# EAGLE design LTC3528 (EAGLE 7.5.0)
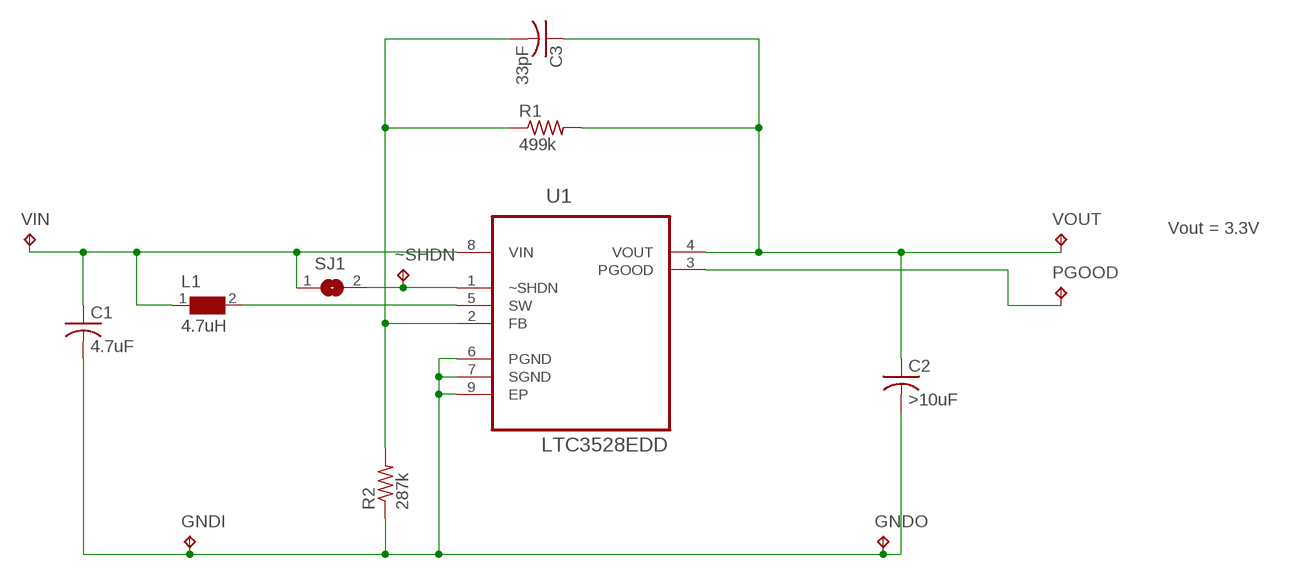
[diagram p0: schematic, sheet 1]

## Parts
C1  4.7uF  C-USC0603  [C0603]
C2  >10uF  C-USC0603  [C0603]
C3  33pF  C-USC0603  [C0603]
GNDI  TPPAD1-13  [P1-13]
GNDO  TPPAD1-13  [P1-13]
L1  4.7uH  WE-TPC-74402500047_2828  [WE-TPC_2828]
PGOOD  TPPAD1-13  [P1-13]
R1  499k  R-US_R0603  [R0603]
R2  287k  R-US_R0603  [R0603]
SJ1  not SHDN  SJ  [SJ]
U1  LTC3528EDD  LTC3528EDDB-2PBF  [DFN300X200X80-9N]
VIN  TPPAD1-13  [P1-13]
VOUT  TPPAD1-13  [P1-13]
~SHDN  TPPAD1-13  [P1-13]

## Nets
GND: C1.2 C2.2 GNDI.TP GNDO.TP R2.1 U1.6(PGND) U1.7(SGND) U1.9(EP)
N$1: SJ1.2 U1.1(~SHDN) ~SHDN.TP
N$3: PGOOD.TP U1.3(PGOOD)
N$4: L1.2 U1.5(SW)
N$8: C3.2 R1.1 R2.2 U1.2(FB)
VIN: C1.1 L1.1 SJ1.1 U1.8(VIN) VIN.TP
VOUT: C2.1 C3.1 R1.2 U1.4(VOUT) VOUT.TP

## Notes on the sheet
- Vout = 3.3V

## Library data of the parts
C1-C3 = rcl:C-US: CAPACITOR, American symbol
GNDI GNDO ~SHDN = testpad:TP: Test pad
L1 = WE-TPC:WE-TPC: Shielded Tiny Power Inductor WE-TPC - Extremely flat power inductor - High current capability - High reliability and perfect soldering characteristics because of integrated soldering pad - magnetically shielded -- Portable power like PDA, digital camera, PCMICA-cards and displays -- DC/DC-converter -- Recommended for switching regulator IC's from Linear Technology, National Semiconductor, Texas Instruments and Fairchild Semiconductor; MPN: 74402500047; OC_FARNELL: 1869738; OC_NEWARK: 32T8550; PACKAGE: 2828; SUPPLIER: WURTH ELEKTRONIK
PGOOD = testpad:TP: Test pad; TP_SIGNAL_NAME: PGOOD
R1 R2 = rcl:R-US_: RESISTOR, American symbol
SJ1 = jumper:SJ: SMD solder JUMPER
U1 = LTC_By_element14_Batch_1:LTC3528EDDB-2PBF: 1A, 1MHz Synchronous Step-Up DC/DC Converters; MPN: LTC3528EDDB-2#PBF; OC_FARNELL: 1783296; OC_NEWARK: 51R1507; PACKAGE: DFN-8; SUPPLIER: Linear Technology
VIN = testpad:TP: Test pad; TP_SIGNAL_NAME: VIN
VOUT = testpad:TP: Test pad; TP_SIGNAL_NAME: VOUT

## Board
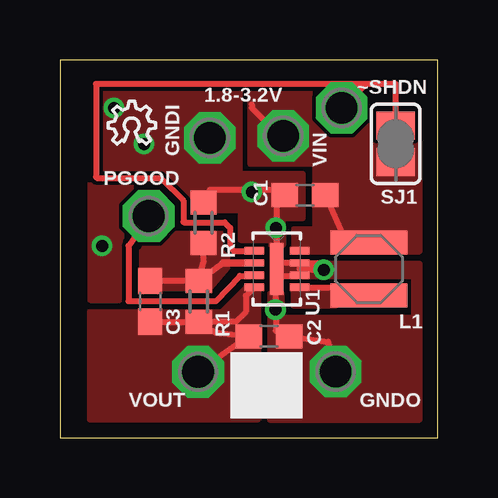
[diagram p1: board, top side]
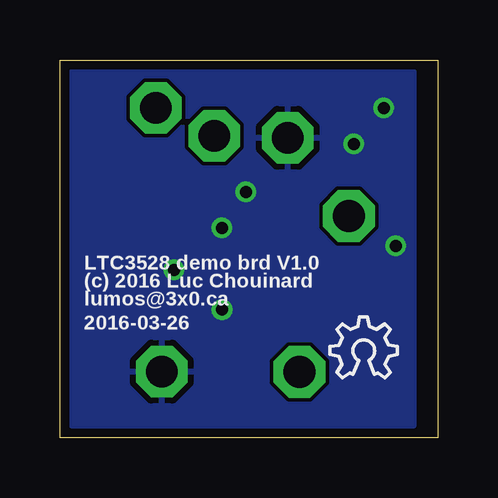
[diagram p2: board, bottom side, seen from below]

Size 15.75 x 15.75 mm. Coordinates in mm from the lower left corner, seen from the top.
Outline: 0,0 15.75,0 15.75,15.75 0,15.75 0,0
Copper layers (1*16): Top 0.0356mm / dielectric 1.5011mm / Bottom 0.0356mm
Design rules "LaenPCBOrder *": minimum track width 6mil, minimum drill 13mil, track to track 6mil, track to pad 6mil, pad to pad 6mil, via to via 6mil, smd to smd 6mil, copper to edge 15mil, drill to drill 6mil, minimum pad ring 7mil, minimum via ring 7mil, stop-mask expansion 3mil, vias tented up to drill 30mil, thermal gap 10mil

### Footprints (pad centres in the part's own frame; a part is rotated, then mirrored left to right if it is on the bottom)
C0603 = smd 1.1 x 1: 1 -0.85,0; 2 0.85,0
P1-13 = drill 1.321 pad 2.159 octagon: TP 0,0
WE-TPC_2828 = smd 3.2 x 1: 1 0,1.1; 2 0,-1.1
R0603 = smd 1 x 1.1: 1 -0.85,0; 2 0.85,0
SJ = smd 1.168 x 1.6: 1 -0.762,0; 2 0.762,0
DFN300X200X80-9N = smd 0.813 x 0.305: 1 -0.94,0.762; 2 -0.94,0.254; 3 -0.94,-0.254; 4 -0.94,-0.762; 5 0.94,-0.762; 6 0.94,-0.254; 7 0.94,0.254; 8 0.94,0.762 | smd 0.559 x 2.159: 9 0,0

### Placement (x,y rotation side)
C1  10.22,10.11 180 top
C2  8.72,4.22 0 top
C3  3.77,5.68 90 top
GNDI  6.25,12.5 0 top
GNDO  11.5,2.75 0 top
L1  12.88,7.03 0 top
PGOOD  3.7,9.24 0 top
R1  5.79,5.68 270 top
R2  5.99,8.96 270 top
SJ1  14,12.25 90 top
U1  9.05,7.03 0 top
U$1  [OSHW_6X70_NOTEXT]  2,12.25 0 top
U$2  [OSHW_6X100_NOTEXT]  4.5,2.5 0 bottom
VIN  9.31,12.58 0 top
VOUT  5.76,2.74 0 top
~SHDN  11.75,13.75 0 top

### Tracks (layer width: path | path; a pad name or v marks a point on that pad's centre or on a via)
GND  (via drill 0.5)
  Top 0.254: 9,6.75 9,7.03 U1.9 9.05,7.28 | 9,6.75 9.99,6.75 U1.6 | 9.05,7.28 U1.7 11,7.28 v11,7 | 9.05,7.28 9.05,10.33 | 9.05,10.33 C1.2 | 9,6.75 v8.99,5.34 9,4.45 C2.2 11.18,4 GNDO.TP | 9.05,10.33 6.51,10.33 | 6.51,10.33 arc90 R2.1 | 6.51,10.33 6.25,10.33 | v11,7 10,7 10,7.25 11,7.25 v11,7
  other vias: 8,10.25 9,8.75 2.25,13.75 3.5,12.25 1.75,8
  pour Bottom: 1,15.25 15.25,15.25 15.25,0.5 1,0.5
  pour Top (no thermals): 9.32,8.05 9.31,9.15 10.13,9.14 10.13,11 7.5,11 7.5,15 1.25,15 1.25,5.75 2.5,5.75 2.5,8.25 3.28,9.52 4.5,9.5 7.53,9.5 7.53,8.25 8.8,8.25 8.8,8.05
  pour Top (no thermals): 8.75,6 8.75,0.75 15,0.75 15,7.25 9.25,7.25 9.25,6.75 14.75,6.75 14.75,5 9.25,5 9.25,6
N$1
  Top 0.254: 12.75,14.75 14,14.75 SJ1.2 | 12.75,14.75 ~SHDN.TP 11.25,14.75 | 12.75,14.75 11.25,14.75 | 11.25,14.75 1.5,14.75 1.5,10.87 1.54,10.83 4.2,10.83 5.15,9.88 5.15,8.99 5.17,8.97 6.87,8.97 7.1,8.74 7.1,7.95 7.27,7.78 8.1,7.78 U1.1
N$3
  Top 0.254: PGOOD.TP 3.7,9.2 2.86,8 2.86,5.69 6.5,5.69 7.5,6.75 8.08,6.75 U1.3
N$4
  Top 0.254: U1.5 12.88,6.27 L1.2
  pour Top (no thermals): 11.5,5.5 9.75,5.5 9.75,6.25 11.5,6.25
N$8
  Top 0.254: R1.1 C3.2 | R1.1 5.99,7.33 R2.2 | R1.1 6.79,7.28
  Top 0.305: 6.79,7.28 U1.2
  pour Top (no thermals): 6.98,7.09 7,8.5 3.8,8.49 3.51,7.87 3.4,7.74 3.4,6.24 6.25,6.25
VIN
  Top 0.254: C1.1 11.95,8.13 L1.1 | 8,13.89 8,13.75 9.25,12.5 | SJ1.1 14.01,11.24 14,11.25
  pour Top (no thermals): 10.64,11.42 10.64,8.68 9.75,8.68 9.75,7.77 15,7.77 15,15 7.93,15.01 7.93,11.42
VOUT
  Top 0.254: U1.4 7.75,5.91 7.75,5.25 7.33,4.83 R1.2 | R1.2 6.48,4.39 C2.1 VOUT.TP | C3.1 R1.2
  pour Top (no thermals): 8.25,6.25 8.25,0.75 1.25,0.75 1.25,5.25 6.75,5.25 7.75,6.25

### Text on the board
tNames: 1.8-3.2V
bNames: LTC3528 demo brd V1.0 | (c) 2016 Luc Chouinard | lumos@3x0.ca | 2016-03-26